# Altium schematic sheet BMS_MAIN.SchDoc
size OrCAD D; SheetNumber: 1; SheetTotal: 3
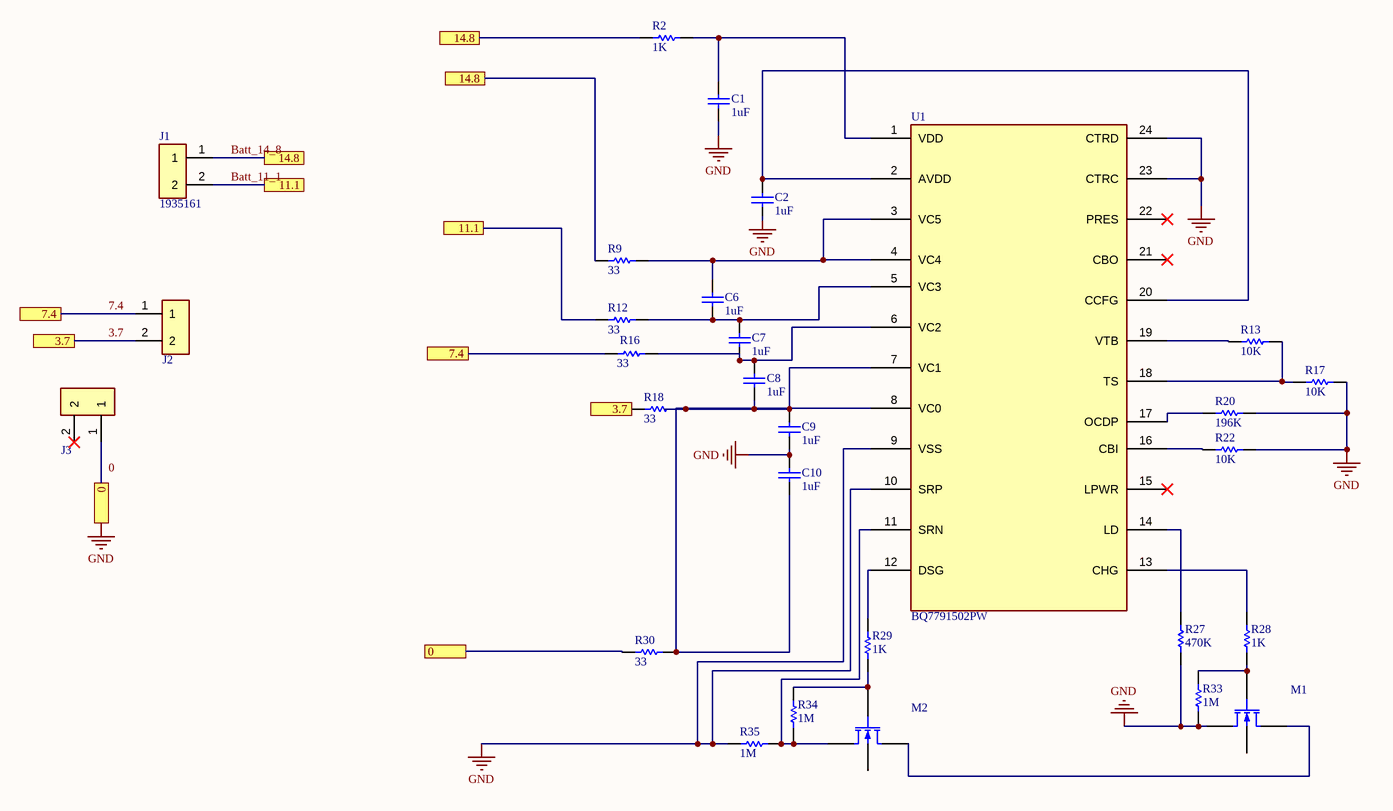
[diagram p0: BMS_MAIN.SchDoc]

## Parts
C1  value 1uF  [0805]  (hidden comment: Capacitor)
C2  value 1uF  [0805]  (hidden comment: Capacitor)
C6  value 1uF  [0805]  (hidden comment: Capacitor)
C7  value 1uF  [0805]  (hidden comment: Capacitor)
C8  value 1uF  [0805]  (hidden comment: Capacitor)
C9  value 1uF  [0805]  (hidden comment: Capacitor)
C10  value 1uF  [0805]  (hidden comment: Capacitor)
J1  1935161  [PHOENIX_1935161]
J2  1935161  [PHOENIX_1935161]  (value not drawn)
J3  1935161  [PHOENIX_1935161]  (value not drawn)
M1  N-channel  MOS1 MOSFET Shichman and Hodges Model  [TO254P1036X470X1965-3]  (value not drawn)
M2  N-channel  MOS1 MOSFET Shichman and Hodges Model  [TO254P1036X470X1965-3]  (value not drawn)
R2  value 1K  [0805]  (hidden comment: Resistor)
R9  value 33  [0805]  (hidden comment: Resistor)
R12  value 33  [0805]  (hidden comment: Resistor)
R13  value 10K  [0805]  (hidden comment: Resistor)
R16  value 33  [0805]  (hidden comment: Resistor)
R17  value 10K  [0805]  (hidden comment: Resistor)
R18  value 33  [0805]  (hidden comment: Resistor)
R20  value 196K  [0805]  (hidden comment: Resistor)
R22  value 10K  [0805]  (hidden comment: Resistor)
R27  value 470K  [0805]  (hidden comment: Resistor)
R28  value 1K  [0805]  (hidden comment: Resistor)
R29  value 1K  [0805]  (hidden comment: Resistor)
R30  value 33  [0805]  (hidden comment: Resistor)
R33  value 1M  [0805]  (hidden comment: Resistor)
R34  value 1M  [0805]  (hidden comment: Resistor)
R35  value 1M  [0805]  (hidden comment: Resistor)
U1  BQ7791502PW  [SOP65P640X120-24N]

## Ports
0 (see BMS_MAIN[7A], Differential_Amp[2D]), 0 (see BMS_MAIN[8A], Differential_Amp[2D]), 3.7 (see BMS_MAIN[7A], Differential_Amp[2C]), 3.7 (see BMS_MAIN[8B], Differential_Amp[2C]), 7.4 (see BMS_MAIN[7A], Differential_Amp[2B]), 7.4 (see BMS_MAIN[8B], Differential_Amp[2B]), 11.1 (see BMS_MAIN[7B], Differential_Amp[2B]), 14.8 (see BMS_MAIN[7B], Buck[2B], Differential_Amp[2A])

## Nets
GND: C1.1 C2.2 C9.2 C10.1 J3.1 M1.3(S) R17.1 R20.2 R22.2 R27.1 R30.2 R33.1 R35.2 U1.9(VSS) U1.10(SRP) U1.23(CTRC) U1.24(CTRD) ; port 0
3.7: J2.2 R18.2 ; port 3.7
7.4: J2.1 R16.2 ; port 7.4
Batt_11_1: J1.2 R12.2 ; port 11.1
Batt_14_8: J1.1 R2.2 R9.2 ; port 14.8
NetC1_2: C1.2 R2.1 U1.1(VDD)
NetC2_1: C2.1 U1.2(AVDD) U1.20(CCFG)
NetC6_1: C6.1 R9.1 U1.3(VC5) U1.4(VC4)
NetC6_2: C6.2 C7.1 R12.1 U1.5(VC3)
NetC7_2: C7.2 C8.1 R16.1 U1.6(VC2)
NetC8_2: C8.2 C9.1 R18.1 U1.7(VC1)
NetC10_2: C10.2 R30.1 U1.8(VC0)
NetM1_1: M1.1(D) M2.1(D)
NetM1_2: M1.2(G) R28.1 R33.2
NetM2_2: M2.2(G) R29.1 R34.2
NetM2_3: M2.3(S) R34.1 R35.1 U1.11(SRN)
NetR13_1: R13.1 U1.19(VTB)
NetR13_2: R13.2 R17.2 U1.18(TS)
NetR20_1: R20.1 U1.17(OCDP)
NetR22_1: R22.1 U1.16(CBI)
NetR27_2: R27.2 U1.14(LD)
NetR28_2: R28.2 U1.13(CHG)
NetR29_2: R29.2 U1.12(DSG)

Not connected (* = marked no-connect by the designer): J3 2*; M1 4(B); M2 4(B); U1 15(LPWR)* 21(CBO)* 22(PRES)*

## Notes on the sheet
- Labels drawn without touching a wire or pin: 0
- DWG NO:
- REV:
- THIS DOCUMENT AND THE DATA DISCLOSED HEREIN OR
- HEREWITH IS THE PROPERTY OF ALTIUM LIMITED AND MAY
- BE FREELY DISTRIBUTED IN WHOLE. NO RIGHTS ARE
- RESERVED OR EXPRESS OR IMPLIED WARANTEE GIVEN.
- REVISION
- DESCRIPTION
- DATE
- APPROVED
- ENG:
- APPROVALS
- PROJECT
- DSN:
- CHK:
- REFERENCE DOCUMENTS
- PROJECT REVISION:
- TITLE
- DOCUMENT REVISION:
- DESIGN ITEM:
- BOM:
- FAB DWG:
- PCB DWG:
- ASSY DWG:
- SCALE:
- A2
- SIZE
- CAGE CODE
- FILE NAME
- DWG NO.
- SHEET
- OF
- REV

## Library data of the parts
C1 C2 C6-C10 = Capacitor: SimulationGenericComponent: True
J1-J3 = 1935161: Conn Terminal Blocks 2 POS 5mm Solder ST Thru-Hole 16A; MF: {'manufacturer': u'Phoenix Contact'}; Package: None; MP: 1935161; Value: *; Price: None; Availability: Unavailable
M1 M2 = MOSFET N-ch Lev1: CBD: 0; FC: 0.5; IS: 1e-14; KP: 2e-05; PB: 0.8; PHI: 0.6; TNOM: 27; SimulationGenericComponent: True; CBS: 0; CGBO: 0; CGDO: 0; CGSO: 0; CJ: 0; CJSW: 0; GAMMA: 0; JS: 0; LAMBDA: 0; LD: 0; MJ: 0.5; MJSW: 0.5; NSS: 0; NSUB: 0; RD: 0; RS: 0; RSH: 0; TOX: 0; TPG: 0; U0: 0; VTO: 0
R2 R9 R12 R13 R16-R18 R20 R22 R27-R30 R33-R35 = Resistor: TC1: 0; SimulationGenericComponent: True; TC2: 0
U1 = BQ7791502PW: 3-Series to 5-Series Stackable Ultra-Low-Power Primary Protector With Autonomous Cell Balancing 24-TSSOP -40 to 85; Package: None; Price: None; Value: *; MP: BQ7791502PW; Availability: Unavailable